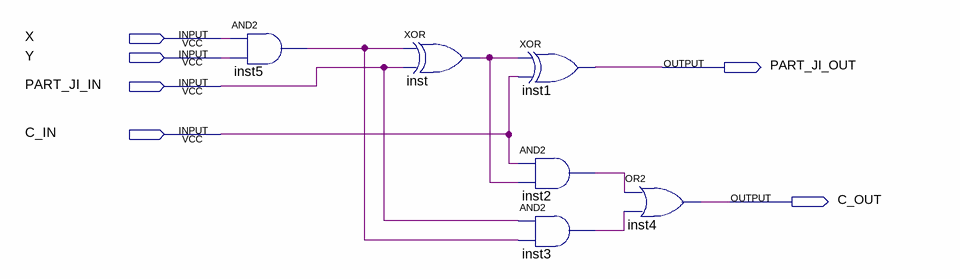
[diagram p0: schematic sheet]
// Quartus schematic ZHENLIE-CHENGFAQI-UNIT.bdf as structural Verilog: 6 symbols, 6 pins
module \ZHENLIE-CHENGFAQI-UNIT  (
  input  X,
  input  Y,
  input  PART_JI_IN,
  input  C_IN,
  output PART_JI_OUT,
  output C_OUT
);

  wire inst2_out, inst3_out, inst5_out, inst_out;

  and inst5 (inst5_out, X, Y);
  xor inst (inst_out, inst5_out, PART_JI_IN);
  xor inst1 (PART_JI_OUT, inst_out, C_IN);
  and inst2 (inst2_out, C_IN, inst_out);
  and inst3 (inst3_out, PART_JI_IN, inst5_out);
  or inst4 (C_OUT, inst2_out, inst3_out);
endmodule
